# EAGLE design driver_controller (EAGLE 6.5.0)
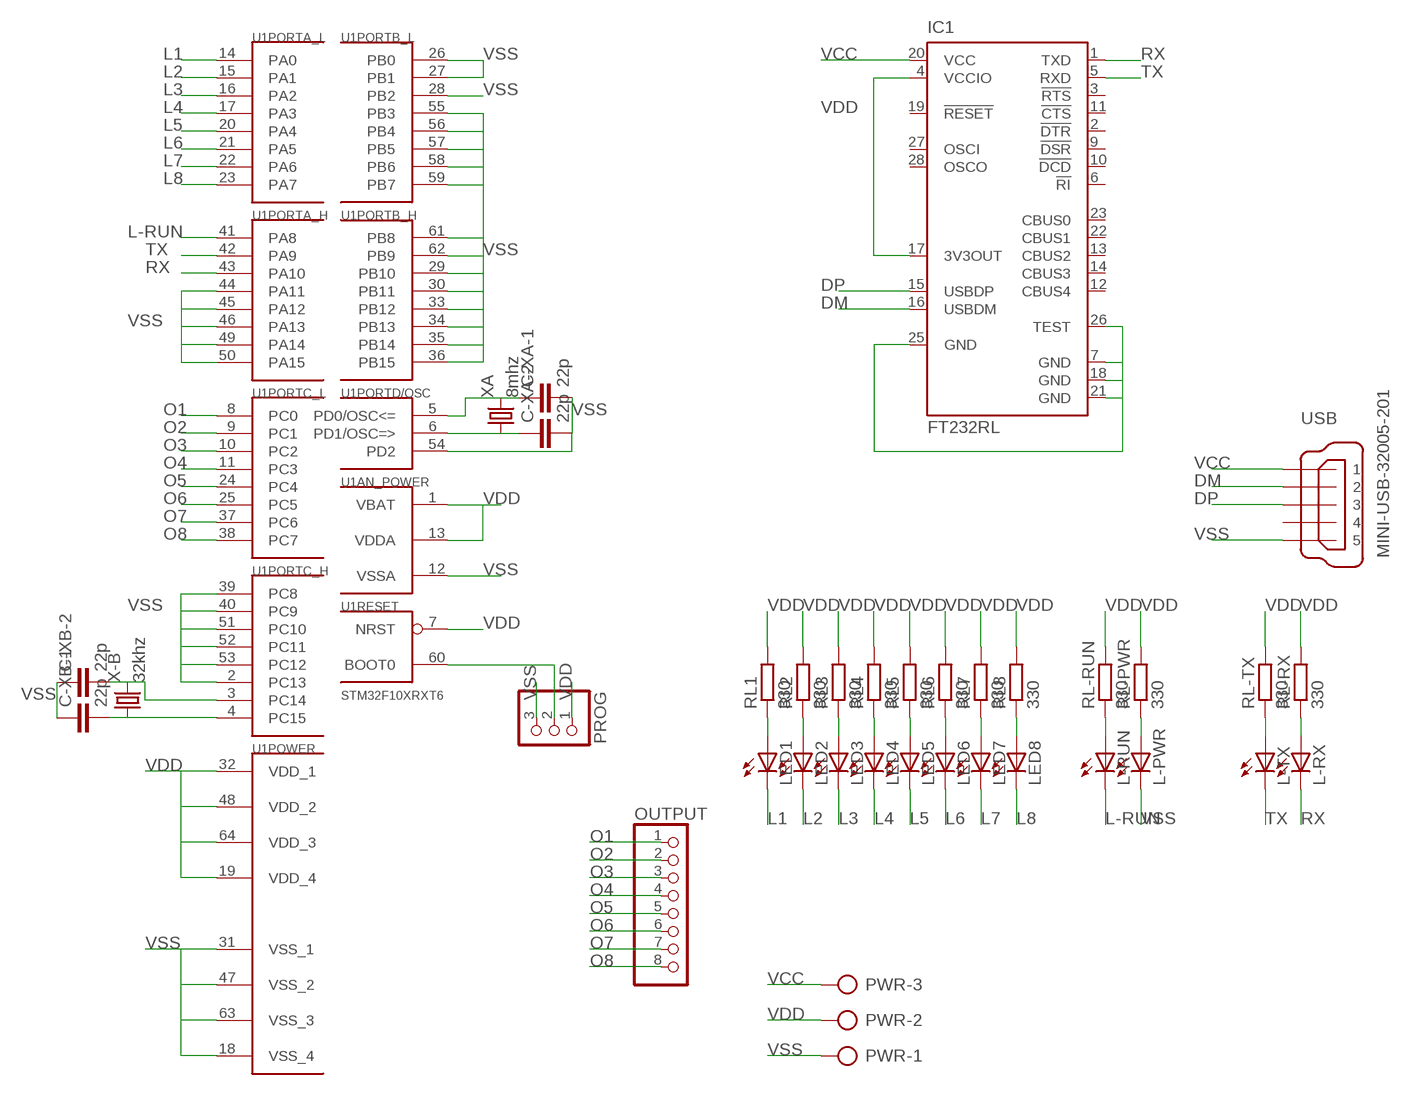
[diagram p0: schematic, sheet 1]

## Parts
C-XA-1  22p  C-EUC1206  [C1206]
C-XA-2  22p  C-EUC1206  [C1206]
C-XB-1  22p  C-EUC1206  [C1206]
C-XB-2  22p  C-EUC1206  [C1206]
IC1  FT232RL  [SSOP28]
L-PWR  LEDSML1206  [SML1206]
L-RUN  LEDSML1206  [SML1206]
L-RX  LEDSML1206  [SML1206]
L-TX  LEDSML1206  [SML1206]
LED1  LEDSML1206  [SML1206]
LED2  LEDSML1206  [SML1206]
LED3  LEDSML1206  [SML1206]
LED4  LEDSML1206  [SML1206]
LED5  LEDSML1206  [SML1206]
LED6  LEDSML1206  [SML1206]
LED7  LEDSML1206  [SML1206]
LED8  LEDSML1206  [SML1206]
OUTPUT  PINHD-1X8  [1X08]
PROG  PINHD-1X3  [1X03]
PWR  AK300/3  [AK300/3]
RL1  330  R-EU_R1206  [R1206]
RL2  330  R-EU_R1206  [R1206]
RL3  330  R-EU_R1206  [R1206]
RL4  330  R-EU_R1206  [R1206]
RL5  330  R-EU_R1206  [R1206]
RL6  330  R-EU_R1206  [R1206]
RL7  330  R-EU_R1206  [R1206]
RL8  330  R-EU_R1206  [R1206]
RL-PWR  330  R-EU_R1206  [R1206]
RL-RUN  330  R-EU_R1206  [R1206]
RL-RX  330  R-EU_R1206  [R1206]
RL-TX  330  R-EU_R1206  [R1206]
U1  STM32F10XRXT6  [TQFP64]
USB  MINI-USB-32005-201  [32005-201]
X-B  32khz  CRYSTALTC26V  [TC26V]
XA  8mhz  CRYSTALHC49S  [HC49/S]

## Nets
DM: IC1.16(USBDM) USB.2
DP: IC1.15(USBDP) USB.3
L1: LED1.C U1.14(PORTA_L:PA0)
L2: LED2.C U1.15(PORTA_L:PA1)
L3: LED3.C U1.16(PORTA_L:PA2)
L4: LED4.C U1.17(PORTA_L:PA3)
L5: LED5.C U1.20(PORTA_L:PA4)
L6: LED6.C U1.21(PORTA_L:PA5)
L7: LED7.C U1.22(PORTA_L:PA6)
L8: LED8.C U1.23(PORTA_L:PA7)
L-RUN: L-RUN.C U1.41(PORTA_H:PA8)
N$2: PROG.2 U1.60(RESET:BOOT0)
N$3: C-XB-1.2 U1.4(PORTC_H:PC15) X-B.1
N$4: C-XB-2.2 U1.3(PORTC_H:PC14) X-B.2
N$5: LED1.A RL1.1
N$6: C-XA-2.1 U1.6(PORTD/OSC:PD1/OSC=>) XA.1
N$7: C-XA-1.1 U1.5(PORTD/OSC:PD0/OSC<=) XA.2
N$8: LED2.A RL2.1
N$9: L-PWR.A RL-PWR.1
N$10: LED3.A RL3.1
N$11: LED4.A RL4.1
N$12: LED5.A RL5.1
N$13: LED6.A RL6.1
N$14: LED7.A RL7.1
N$15: LED8.A RL8.1
N$16: L-RUN.A RL-RUN.1
N$17: L-TX.A RL-TX.1
N$18: L-RX.A RL-RX.1
O1: OUTPUT.1 U1.8(PORTC_L:PC0)
O2: OUTPUT.2 U1.9(PORTC_L:PC1)
O3: OUTPUT.3 U1.10(PORTC_L:PC2)
O4: OUTPUT.4 U1.11(PORTC_L:PC3)
O5: OUTPUT.5 U1.24(PORTC_L:PC4)
O6: OUTPUT.6 U1.25(PORTC_L:PC5)
O7: OUTPUT.7 U1.37(PORTC_L:PC6)
O8: OUTPUT.8 U1.38(PORTC_L:PC7)
RX: IC1.1(TXD) L-RX.C U1.43(PORTA_H:PA10)
TX: IC1.5(RXD) L-TX.C U1.42(PORTA_H:PA9)
VCC: IC1.20(VCC) PWR.3 USB.1
VDD: IC1.4(VCCIO) IC1.17(3V3OUT) PROG.1 PWR.2 RL1.2 RL2.2 RL3.2 RL4.2 RL5.2 RL6.2 RL7.2 RL8.2 RL-PWR.2 RL-RUN.2 RL-RX.2 RL-TX.2 U1.1(AN_POWER:VBAT) U1.7(RESET:NRST) U1.13(AN_POWER:VDDA) U1.19(POWER:VDD_4) U1.32(POWER:VDD_1) U1.48(POWER:VDD_2) U1.64(POWER:VDD_3)
VSS: C-XA-1.2 C-XA-2.2 C-XB-1.1 C-XB-2.1 IC1.7(GND) IC1.18(GND) IC1.21(GND) IC1.25(GND) IC1.26(TEST) L-PWR.C PROG.3 PWR.1 U1.2(PORTC_H:PC13) U1.12(AN_POWER:VSSA) U1.18(POWER:VSS_4) U1.26(PORTB_L:PB0) U1.27(PORTB_L:PB1) U1.28(PORTB_L:PB2) U1.29(PORTB_H:PB10) U1.30(PORTB_H:PB11) U1.31(POWER:VSS_1) U1.33(PORTB_H:PB12) U1.34(PORTB_H:PB13) U1.35(PORTB_H:PB14) U1.36(PORTB_H:PB15) U1.39(PORTC_H:PC8) U1.40(PORTC_H:PC9) U1.44(PORTA_H:PA11) U1.45(PORTA_H:PA12) U1.46(PORTA_H:PA13) U1.47(POWER:VSS_2) U1.49(PORTA_H:PA14) U1.50(PORTA_H:PA15) U1.51(PORTC_H:PC10) U1.52(PORTC_H:PC11) U1.53(PORTC_H:PC12) U1.54(PORTD/OSC:PD2) U1.55(PORTB_L:PB3) U1.56(PORTB_L:PB4) U1.57(PORTB_L:PB5) U1.58(PORTB_L:PB6) U1.59(PORTB_L:PB7) U1.61(PORTB_H:PB8) U1.62(PORTB_H:PB9) U1.63(POWER:VSS_3) USB.5
Unconnected: IC1.2(!DTR) IC1.3(!RTS) IC1.6(!RI) IC1.9(!DSR) IC1.10(!DCD) IC1.11(!CTS) IC1.12(CBUS4) IC1.13(CBUS2) IC1.14(CBUS3) IC1.19(!RESET) IC1.22(CBUS1) IC1.23(CBUS0) IC1.27(OSCI) IC1.28(OSCO) USB.4

## Library data of the parts
C-XA-1 C-XA-2 C-XB-1 C-XB-2 = resistor:C-EU: CAPACITOR, European symbol
IC1 = ftdichip:FT232R: Source: http://www.ftdichip.com/Documents/DataSheets/DS_FT232R_v104.pdf; MPN: FT232RL; OC_FARNELL: 1146032; OC_NEWARK: 91K9918
L-PWR L-RUN L-RX L-TX LED1-LED8 = led:LED: LED OSRAM: - CHIPLED LG R971, LG N971, LY N971, LG Q971, LY Q971, LO R971, LY R971 LH N974, LH R974 LS Q976, LO Q976, LY Q976 LO Q996 - Hyper CHIPLED LW Q18S LB Q993, LB Q99A, LB R99A - SideLED LS A670, LO A670, LY A670, LG A670, LP A670 LB A673, LV A673, LT A673, LW A673 LH A674 LY A675 LS A676, LA A676, LO A676, LY A676, LW A676 LS A679, LY A679, LG A679 - Hyper Micro SIDELED® LS Y876, LA Y876, LO Y876, LY Y876 LT Y87S - SmartLED LW L88C, LW L88S LB L89C, LB L89S, LG L890 LS L89K, LO L89K, LY L89K LS L896, LA L896, LO L896, LY L896 - TOPLED LS T670, LO T670, LY T670, LG T670, LP T670 LSG T670, LSP T670, LSY T670, LOP T670, LYG T670 LG T671, LOG T671, LSG T671 LB T673, LV T673, LT T673, LW T673 LH T674 LS T676, LA T676, LO T676, LY T676, LB T676, LH T676, LSB T676, LW T676 LB T67C, LV T67C, LT T67C, LS T67K, LO T67K, LY T67K, LW E67C LS E67B, LA E67B, LO E67B, LY E67B, LB E67C, LV E67C, LT E67C LW T67C LS T679, LY T679, LG T679 LS T770, LO T770, LY T770, LG T770, LP T770 LB T773, LV T773, LT T773, LW T773 LH T774 LS E675, LA E675, LY E675, LS T675 LS T776, LA T776, LO T776, LY T776, LB T776 LHGB T686 LT T68C, LB T68C - Hyper Mini TOPLED® LB M676 - Mini TOPLED Santana® LG M470 LS M47K, LO M47K, LY M47K Source: http://www.osram.convergy.de LUXEON: - LUMILED® LXK2-PW12-R00, LXK2-PW12-S00, LXK2-PW14-U00, LXK2-PW14-V00 LXK2-PM12-R00, LXK2-PM12-S00, LXK2-PM14-U00 LXK2-PE12-Q00, LXK2-PE12-R00, LXK2-PE12-S00, LXK2-PE14-T00, LXK2-PE14-U00 LXK2-PB12-K00, LXK2-PB12-L00, LXK2-PB12-M00, LXK2-PB14-N00, LXK2-PB14-P00, LXK2-PB14-Q00 LXK2-PR12-L00, LXK2-PR12-M00, LXK2-PR14-Q00, LXK2-PR14-R00 LXK2-PD12-Q00, LXK2-PD12-R00, LXK2-PD12-S00 LXK2-PH12-R00, LXK2-PH12-S00 LXK2-PL12-P00, LXK2-PL12-Q00, LXK2-PL12-R00 Source: www.luxeon.com KINGBRIGHT: KA-3528ASYC Source: www.kingbright.com
OUTPUT = pinhead:PINHD-1X8: PIN HEADER
PROG = pinhead:PINHD-1X3: PIN HEADER
PWR = con-ptr500:AK300/3: CONNECTOR; OC_FARNELL: unknown; OC_NEWARK: unknown
RL1-RL8 RL-PWR RL-RUN RL-RX RL-TX = resistor:R-EU_: RESISTOR, European symbol
U1 = stm32:STM32F10XRXT6: STM32F101/103 64pin LQFP
USB = con-cypressindustries:MINI-USB-: MINI USB-B Conector Source: www.cypressindustries.com; OC_FARNELL: unknown; OC_NEWARK: unknown
X-B = crystal:CRYSTAL: CRYSTAL; OC_FARNELL: unknown; OC_NEWARK: unknown
XA = crystal:CRYSTAL: CRYSTAL; OC_FARNELL: 1667008; OC_NEWARK: unknown

## Board
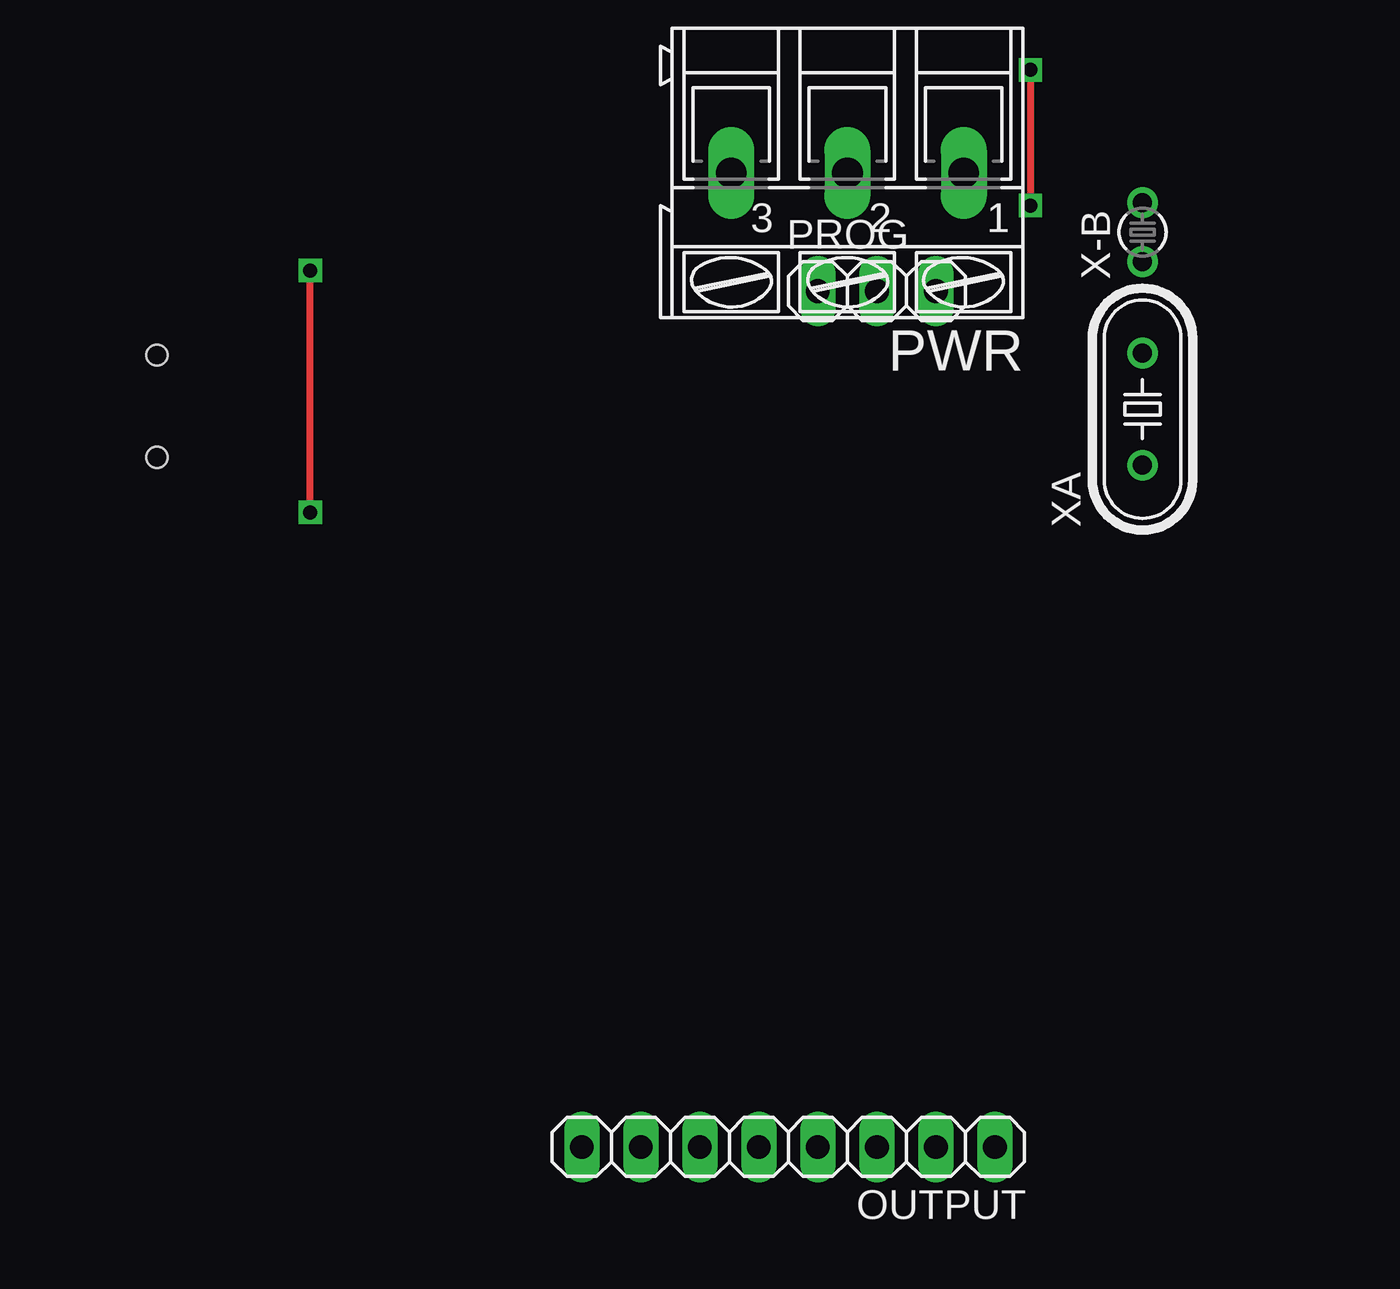
[diagram p1: board, top side]
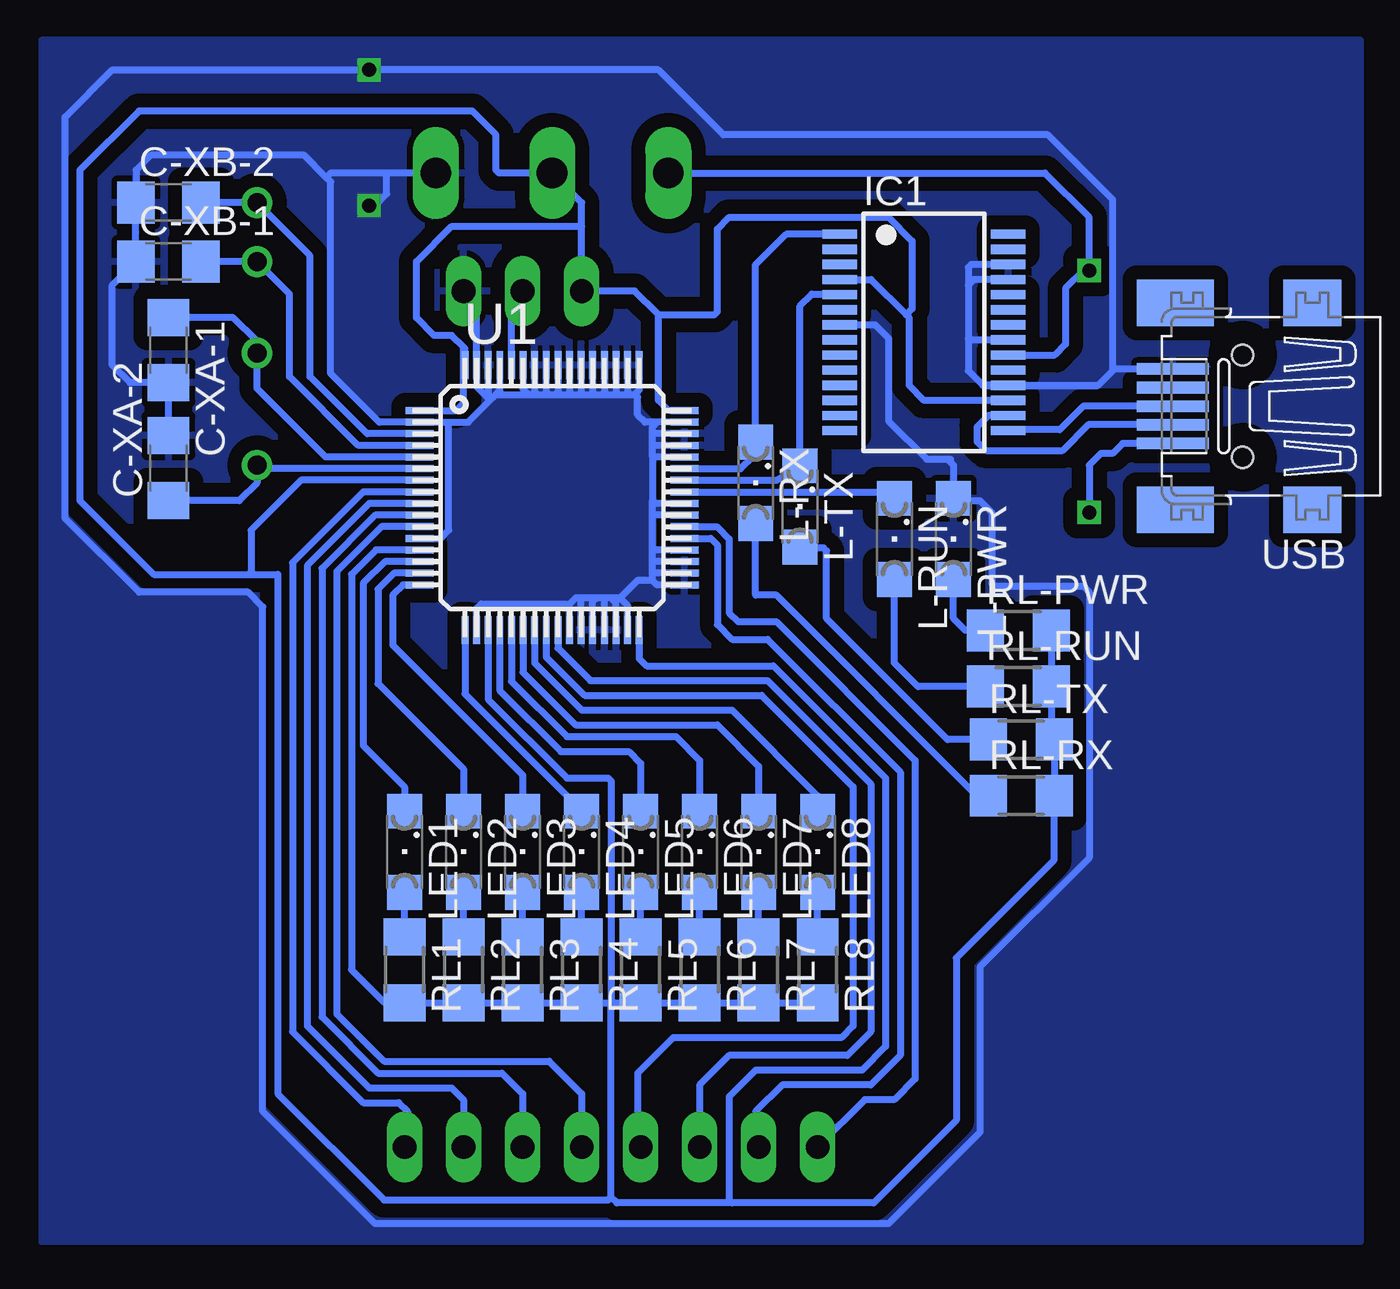
[diagram p2: board, bottom side, seen from below]

No outline drawn. Coordinates in mm, seen from the top.
Copper layers (1*16): Top 0.035mm / dielectric 1.5mm / Bottom 0.035mm
Design rules "default": minimum track width 10mil, minimum drill 24mil, track to track 8mil, track to pad 8mil, pad to pad 8mil, via to via 8mil, smd to smd 8mil, copper to edge 40mil, drill to drill 8mil, minimum pad ring 10mil, minimum via ring 8mil, stop-mask expansion 4mil, vias tented up to drill 0mil, thermal gap 10mil

### Footprints (pad centres in the part's own frame; a part is rotated, then mirrored left to right if it is on the bottom)
C1206 = smd 1.6 x 1.8: 1 -1.4,0; 2 1.4,0
SSOP28 = smd 0.4 x 1.5: 1 -4.225,-3.625; 2 -3.575,-3.625; 3 -2.925,-3.625; 4 -2.275,-3.625; 5 -1.625,-3.625; 6 -0.975,-3.625; 7 -0.325,-3.625; 8 0.325,-3.625; 9 0.975,-3.625; 10 1.625,-3.625; 11 2.275,-3.625; 12 2.925,-3.625; 13 3.575,-3.625; 14 4.225,-3.625; 15 4.225,3.625; 16 3.575,3.625; 17 2.925,3.625; 18 2.275,3.625; 19 1.625,3.625; 20 0.975,3.625; 21 0.325,3.625; 22 -0.325,3.625; 23 -0.975,3.625; 24 -1.625,3.625; 25 -2.275,3.625; 26 -2.925,3.625; 27 -3.575,3.625; 28 -4.225,3.625
SML1206 = smd 1.5 x 1.5: A 1.75,0; C -1.75,0
1X08 = drill 1.016 long: 1 -8.89,0; 2 -6.35,0; 3 -3.81,0; 4 -1.27,0; 5 1.27,0; 6 3.81,0; 7 6.35,0; 8 8.89,0
1X03 = drill 1.016 long: 1 -2.54,0; 2 0,0; 3 2.54,0
AK300/3 = drill 1.321 long: 1 -5.004,0; 2 0,0; 3 5.004,0
R1206 = smd 1.6 x 1.803: 1 -1.422,0; 2 1.422,0
TQFP64 = smd 1.2 x 0.3: 1 -5.7,3.75; 2 -5.7,3.25; 3 -5.7,2.75; 4 -5.7,2.25; 5 -5.7,1.75; 6 -5.7,1.25; 7 -5.7,0.75; 8 -5.7,0.25; 9 -5.7,-0.25; 10 -5.7,-0.75; 11 -5.7,-1.25; 12 -5.7,-1.75; 13 -5.7,-2.25; 14 -5.7,-2.75; 15 -5.7,-3.25; 16 -5.7,-3.75; 33 5.7,-3.75; 34 5.7,-3.25; 35 5.7,-2.75; 36 5.7,-2.25; 37 5.7,-1.75; 38 5.7,-1.25; 39 5.7,-0.75; 40 5.7,-0.25; 41 5.7,0.25; 42 5.7,0.75; 43 5.7,1.25; 44 5.7,1.75; 45 5.7,2.25; 46 5.7,2.75; 47 5.7,3.25; 48 5.7,3.75 | smd 0.3 x 1.2: 17 -3.75,-5.7; 18 -3.25,-5.7; 19 -2.75,-5.7; 20 -2.25,-5.7; 21 -1.75,-5.7; 22 -1.25,-5.7; 23 -0.75,-5.7; 24 -0.25,-5.7; 25 0.25,-5.7; 26 0.75,-5.7; 27 1.25,-5.7; 28 1.75,-5.7; 29 2.25,-5.7; 30 2.75,-5.7; 31 3.25,-5.7; 32 3.75,-5.7; 49 3.75,5.7; 50 3.25,5.7; 51 2.75,5.7; 52 2.25,5.7; 53 1.75,5.7; 54 1.25,5.7; 55 0.75,5.7; 56 0.25,5.7; 57 -0.25,5.7; 58 -0.75,5.7; 59 -1.25,5.7; 60 -1.75,5.7; 61 -2.25,5.7; 62 -2.75,5.7; 63 -3.25,5.7; 64 -3.75,5.7
32005-201 = smd 3.1 x 0.5: 1 3,1.6; 2 3,0.8; 3 3,0; 4 3,-0.8; 5 3,-1.6 | smd 2.5 x 2: M1 -3,-4.45; M2 -3,4.45 | smd 3.3 x 2: M3 2.9,4.45; M4 2.9,-4.45 | hole 0.9: 0,2.2; 0,-2.2
TC26V = drill 0.813: 1 -1.27,0; 2 1.27,0
HC49/S = drill 0.813: 1 -2.413,0; 2 2.413,0

### Placement (x,y rotation side)
C-XA-1  63.5,48.26 270 bottom
C-XA-2  63.5,43.18 90 bottom
C-XB-1  63.5,52.07 0 bottom
C-XB-2  63.5,54.61 0 bottom
IC1  30.99,49.02 270 bottom
L-PWR  29.72,40.13 270 bottom
L-RUN  32.26,40.13 270 bottom
L-RX  38.23,42.55 270 bottom
L-TX  36.32,41.53 270 bottom
LED1  53.34,26.67 270 bottom
LED2  50.8,26.67 270 bottom
LED3  48.26,26.67 270 bottom
LED4  45.72,26.67 270 bottom
LED5  43.18,26.67 270 bottom
LED6  40.64,26.67 270 bottom
LED7  38.1,26.67 270 bottom
LED8  35.56,26.67 270 bottom
OUTPUT  44.45,13.97 180 top
PROG  48.26,50.8 0 top
PWR  46.99,55.88 180 top
RL1  53.34,21.59 270 bottom
RL2  50.8,21.59 270 bottom
RL3  48.26,21.59 270 bottom
RL4  45.72,21.59 270 bottom
RL5  43.18,21.59 270 bottom
RL6  40.64,21.59 270 bottom
RL7  38.1,21.59 270 bottom
RL8  35.56,21.59 270 bottom
RL-PWR  26.92,36.2 0 bottom
RL-RUN  26.92,33.78 0 bottom
RL-RX  26.8,29.08 0 bottom
RL-TX  26.8,31.5 0 bottom
U1  46.99,41.91 0 bottom
USB  17.27,45.85 180 bottom
X-B  59.69,53.34 90 top
XA  59.69,45.72 90 top

### Tracks (layer width: path | path; a pad name or v marks a point on that pad's centre or on a via)
DM
  Bottom 0.305: IC1.16 28.21,45.45 28.7,44.96 28.7,44.32 28.32,43.94 25.02,43.94 23.91,45.05 USB.2
DP
  Bottom 0.305: USB.3 24.13,45.85 25.15,44.83 27.33,44.83 IC1.15
L1
  Bottom 0.305: U1.14 54.19,39.16 55.12,38.23 55.12,31.24 53.34,29.46 LED1.C
L2
  Bottom 0.305: U1.15 53.8,38.66 54.48,37.97 54.48,33.91 50.8,30.23 LED2.C
L3
  Bottom 0.305: U1.16 53.41,38.16 53.85,37.72 53.85,35.56 48.26,29.97 LED3.C
L4
  Bottom 0.305: U1.17 50.74,33.47 46.35,29.08 46.35,29.05 LED4.C
L5
  Bottom 0.305: U1.20 49.24,33.62 46.61,30.99 43.69,30.99 43.18,30.48 LED5.C
L6
  Bottom 0.305: U1.21 48.74,34.01 46.35,31.62 41.66,31.62 40.64,30.61 LED6.C
L7
  Bottom 0.305: U1.22 48.24,34.4 45.97,32.13 39.88,32.13 38.1,30.35 LED7.C
L8
  Bottom 0.305: U1.23 47.74,34.79 45.72,32.77 39.24,32.77 35.56,29.08 LED8.C
L-RUN
  Bottom 0.305: 32.49,41.65 L-RUN.C 32.54,42.16 U1.41
N$2
  Bottom 0.305: U1.60 48.74,50.32 PROG.2
N$3
  Bottom 0.305: U1.4 55.34,44.16 58.29,47.12 58.29,50.67 X-B.1 C-XB-1.2
N$4
  Bottom 0.305: U1.3 54.95,44.66 57.4,47.12 57.4,52.32 X-B.2 C-XB-2.2
N$5
  Bottom 0.305: RL1.1 LED1.A
N$6
  Bottom 0.305: U1.6 59.54,43.16 XA.1 59.69,42.55 60.45,41.78 C-XA-2.1
N$7
  Bottom 0.305: U1.5 56.74,43.66 59.69,46.61 XA.2 59.69,48.64 60.71,49.66 C-XA-1.1
N$8
  Bottom 0.305: RL2.1 LED2.A
N$9
  Bottom 0.305: RL-PWR.1 29.21,36.2 29.72,36.7 L-PWR.A
N$10
  Bottom 0.305: RL3.1 LED3.A
N$11
  Bottom 0.305: RL4.1 LED4.A
N$12
  Bottom 0.305: RL5.1 LED5.A
N$13
  Bottom 0.305: RL6.1 LED6.A
N$14
  Bottom 0.305: RL7.1 LED7.A
N$15
  Bottom 0.305: RL8.1 LED8.A
N$16
  Bottom 0.305: RL-RUN.1 31.24,33.78 32.26,34.8 L-RUN.A
N$17
  Bottom 0.305: RL-TX.1 29.97,31.5 35.18,36.7 35.18,39.62 35.31,39.75 36.29,39.75 L-TX.A
N$18
  Bottom 0.305: RL-RX.1 28.7,29.08 37.34,37.72 38.23,37.72 L-RX.A
O1
  Bottom 0.305: U1.8 55.12,42.16 58.17,39.12 58.17,18.92 55.12,15.88 53.59,15.88 53.21,15.49 53.21,14.1 OUTPUT.1
O2
  Bottom 0.305: U1.9 54.86,41.66 57.53,38.99 57.53,19.18 54.86,16.51 51.31,16.51 50.8,16 OUTPUT.2
O3
  Bottom 0.305: U1.10 54.6,41.16 56.9,38.86 56.9,19.56 54.48,17.14 49.15,17.14 48.26,16.26 OUTPUT.3
O4
  Bottom 0.305: U1.11 54.34,40.66 56.26,38.73 56.26,19.68 54.23,17.65 47.12,17.65 45.72,16.26 OUTPUT.4
O5
  Bottom 0.305: U1.24 47.24,35.05 45.59,33.4 37.97,33.4 34.04,29.46 34.04,19.18 34.54,18.67 41.78,18.67 43.31,17.14 43.31,14.1 OUTPUT.5
O6
  Bottom 0.305: U1.25 46.74,35.44 45.34,34.04 37.72,34.04 33.27,29.59 33.27,18.92 34.29,17.91 39.37,17.91 40.64,16.64 OUTPUT.6
O7
  Bottom 0.305: U1.37 40.16,40.16 39.88,39.88 39.88,36.45 39.24,35.81 37.72,35.81 32,30.1 32,17.91 33.27,16.64 37.08,16.64 38.23,15.49 38.23,14.1 OUTPUT.7
O8
  Bottom 0.305: U1.38 39.9,40.66 39.37,40.13 39.37,36.96 38.99,36.58 37.34,36.58 31.37,30.61 31.37,16.89 32.26,16 33.53,16 OUTPUT.8
RX
  Bottom 0.305: U1.43 38.88,43.16 38.35,43.69 38.35,44.17 L-RX.C 38.23,51.94 36.92,53.25 IC1.1
TX
  Bottom 0.305: U1.42 37.32,42.66 L-TX.C 36.32,50.16 35.81,50.67 34.64,50.67 IC1.5
VCC  (via drill 0.6)
  Top 0.305: v23.88,41.27 v23.88,51.69
  Bottom 0.305: USB.1 22.43,44.25 22.86,43.81 23.37,43.81 23.88,43.31 v23.88,41.27 | IC1.20 25.36,48.05 24.89,48.51 24.89,50.93 24.13,51.69 v23.88,51.69 23.88,53.98 25.78,55.88 PWR.3
VDD
  Bottom 0.305: 44.58,20.17 RL4.2 RL3.2 RL2.2 RL1.2 53.37,20.19 54.23,20.19 55.63,21.59 55.63,38.61 54.57,39.66 U1.13 | 44.58,20.17 44.32,20.17 | 44.32,20.17 RL5.2 RL6.2 RL7.2 RL8.2 | 50.8,47.55 50.8,45.97 51.11,45.66 U1.1 | 50.8,47.55 U1.64 50.74,48.33 50.8,48.39 | U1.19 49.74,33.23 46.35,29.84 44.58,29.84 44.45,29.72 44.45,20.3 44.32,20.17 | 45.72,53.59 PROG.1 43.43,50.8 42.42,49.78 | U1.48 41.98,45.66 42.42,46.1 42.42,49.78 | 50.8,47.55 50.8,48.39 | 50.8,48.39 51.31,48.9 52.07,48.9 52.83,49.66 52.83,52.07 51.31,53.59 45.72,53.59 | 45.72,53.59 45.72,54.61 PWR.2 49.28,55.88 49.4,56.01 49.4,57.53 50.42,58.55 64.77,58.55 67.31,56.01 67.31,41.78 64.14,38.61 59.82,38.61 | 59.82,38.61 58.8,38.61 58.8,16.26 54.23,11.68 44.58,11.68 44.45,11.81 | 44.45,11.81 44.45,20.04 44.58,20.17 | 39.24,11.56 33.15,11.56 29.59,15.11 29.59,22.1 25.4,26.29 25.4,29.21 | 39.24,11.56 44.2,11.56 44.45,11.81 | IC1.17 30.98,46.1 31.62,46.74 31.62,49.66 31.75,49.78 | 31.75,49.78 33.26,51.3 IC1.4 | 42.42,49.78 40.01,49.78 39.88,49.91 39.88,53.47 39.37,53.98 32.51,53.98 31.5,52.96 31.5,50.04 31.75,49.78 | U1.7 57.8,42.66 59.94,40.51 59.94,38.73 59.82,38.61 | U1.32 43.24,34.98 42.93,34.67 37.47,34.67 32.64,29.84 32.64,18.29 33.66,17.27 38.23,17.27 39.37,16.13 39.37,11.68 39.24,11.56 | RL-PWR.2 RL-RUN.2 25.5,31.37 | 25.53,30.73 25.5,30.76 25.5,31.37 | RL-TX.2 RL-RX.2 | RL-TX.2 25.38,29.23 25.4,29.21 | 25.4,29.21 25.4,29.34 25.53,29.46 25.53,29.34 25.4,29.21 | 25.5,31.37 RL-TX.2
VSS  (via drill 0.6)
  Top 0.305: v54.86,60.33 v54.86,54.48
  Bottom 0.305: C-XA-2.2 C-XA-1.2 65.15,46.86 65.91,47.62 65.91,51.06 C-XB-1.1 C-XB-2.1 64.9,56.01 64.26,56.64 57.66,56.64 56.71,55.69 | U1.31 43.74,37.26 44.07,37.59 | 44.07,37.59 44.45,37.59 | 44.45,37.59 44.83,37.59 | 44.83,37.59 45.09,37.59 | 45.09,37.59 45.72,37.59 | 45.72,37.59 45.97,37.59 46.24,37.33 | U1.26 46.24,37.33 | U1.27 45.74,37.57 45.72,37.59 | U1.28 45.24,37.44 45.09,37.59 | U1.29 44.74,37.5 44.83,37.59 | U1.30 44.24,37.38 44.45,37.59 | U1.33 42.48,38.16 42.67,38.35 | 42.67,38.35 42.67,38.61 | 42.67,38.61 42.67,39.12 | 42.67,39.12 42.67,39.62 | 42.67,39.62 42.67,41.15 | 42.67,41.15 42.67,41.66 | 42.67,41.66 42.67,41.78 | 42.67,43.69 42.67,44.2 | 42.67,44.2 42.67,44.7 | 42.67,44.7 42.67,44.96 42.47,45.16 | U1.46 42.63,44.66 42.67,44.7 | U1.45 42.64,44.16 42.67,44.2 | U1.44 42.64,43.66 42.67,43.69 | U1.40 42.67,41.66 | U1.39 42.66,41.16 42.67,41.15 | U1.36 42.64,39.66 42.67,39.62 | U1.35 42.63,39.16 42.67,39.12 | U1.34 42.62,38.66 42.67,38.61 | 42.67,38.35 43.31,38.35 44.07,37.59 | U1.59 48.24,46.59 48.01,46.35 47.62,46.35 | 47.62,46.35 47.12,46.35 | 47.12,46.35 46.86,46.35 | 46.86,46.35 46.23,46.35 | 46.23,46.35 45.72,46.35 | 45.72,46.35 45.21,46.35 | 45.21,46.35 44.83,46.35 | 44.83,46.35 44.32,46.35 | 44.32,46.35 43.69,46.35 | 43.69,46.35 43.43,46.35 | 43.43,46.35 43.24,46.55 U1.49 | U1.50 43.74,46.41 43.69,46.35 | U1.51 44.24,46.44 44.32,46.35 | U1.52 44.74,46.45 44.83,46.35 | U1.53 45.24,46.38 45.21,46.35 | U1.54 45.74,46.38 45.72,46.35 | U1.55 46.24,46.37 46.23,46.35 | U1.56 46.74,46.48 46.86,46.35 | U1.57 47.24,46.48 47.12,46.35 | U1.58 47.74,46.47 | 47.74,46.47 47.62,46.35 | 42.47,45.16 43,45.16 43.31,45.47 43.31,46.23 43.43,46.35
  Bottom 0.305: 49.4,46.35 49.53,46.23 | 49.53,46.23 49.78,46.23 | U1.62 49.74,46.27 49.78,46.23 | 49.78,46.23 50.24,46.68 U1.63 50.24,50.24 PROG.3 | U1.61 49.24,46.52 49.4,46.35 | 49.4,46.35 47.85,46.35 47.74,46.47 | 51.44,45.16 U1.2 54.43,45.16 56.52,47.24 56.52,55.5 56.71,55.69 | 51.44,45.16 50.6,45.16 49.53,46.23 | U1.12 51.79,40.16 51.44,40.51 51.44,45.16 | U1.18 50.24,37.14 50.04,37.34 46.25,37.34 46.24,37.33 | IC1.26 28.95,51.95 29.08,51.82 29.08,51.05 | 29.08,51.05 29.08,48.77 | 28.46,46.75 29.08,47.37 29.08,48.77 | 28.46,46.75 IC1.18 23.48,46.75 | IC1.21 29.01,48.7 29.08,48.77 | IC1.25 28.84,51.3 29.08,51.05 | 42.67,43.69 42.67,41.78 | 42.67,41.78 42.55,41.66 | U1.47 42.47,45.16 | USB.5 22.78,47.45 22.86,47.37 | 22.86,47.37 23.48,46.75 | PWR.1 54.1,55.88 | 54.1,55.88 56.52,55.88 56.71,55.69 | IC1.7 33.09,49.35 32.51,48.77 32.51,45.21 30.86,43.56 29.97,43.56 | 29.97,43.56 29.84,43.43 | 29.72,41.91 L-PWR.C | 28.46,46.75 28.45,46.74 23.5,46.74 23.48,46.75 | 22.86,47.37 22.86,54.74 25.65,57.53 39.62,57.53 42.42,60.33 v54.86,60.33 65.91,60.33 67.94,58.29 67.94,41.02 64.77,37.85 60.07,37.85 59.44,37.21 59.44,15.49 54.61,10.67 32.51,10.67 28.57,14.61 28.57,21.72 23.88,26.42 23.88,37.85 24.13,38.1 27.94,38.1 28.07,38.23 28.07,41.27 28.57,41.78 29.59,41.78 29.72,41.91 | v54.86,54.48 54.61,54.48 54.1,54.99 54.1,55.88 | 29.97,43.56 29.84,43.56 29.84,43.43 | 29.84,43.43 29.72,43.31 29.72,41.91
  pour Bottom (isolate 0.61): 12.19,61.59 68.96,61.59 68.96,9.91 12.19,9.91